# EAGLE board Lusso (EAGLE 9.0.0)
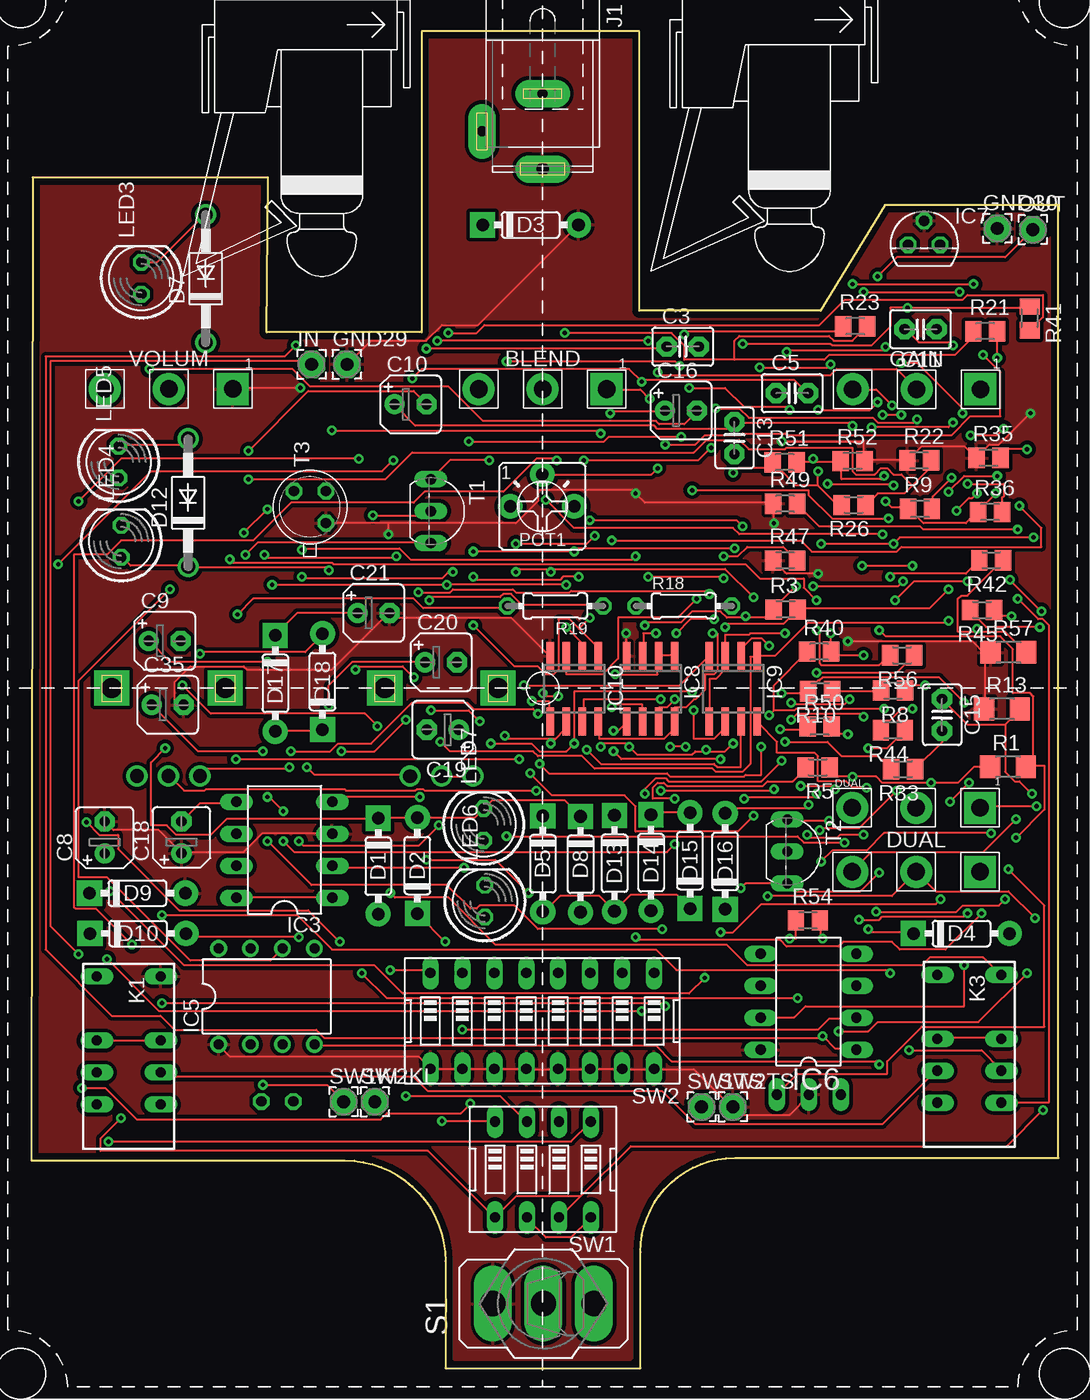
[diagram p2: board, top side]
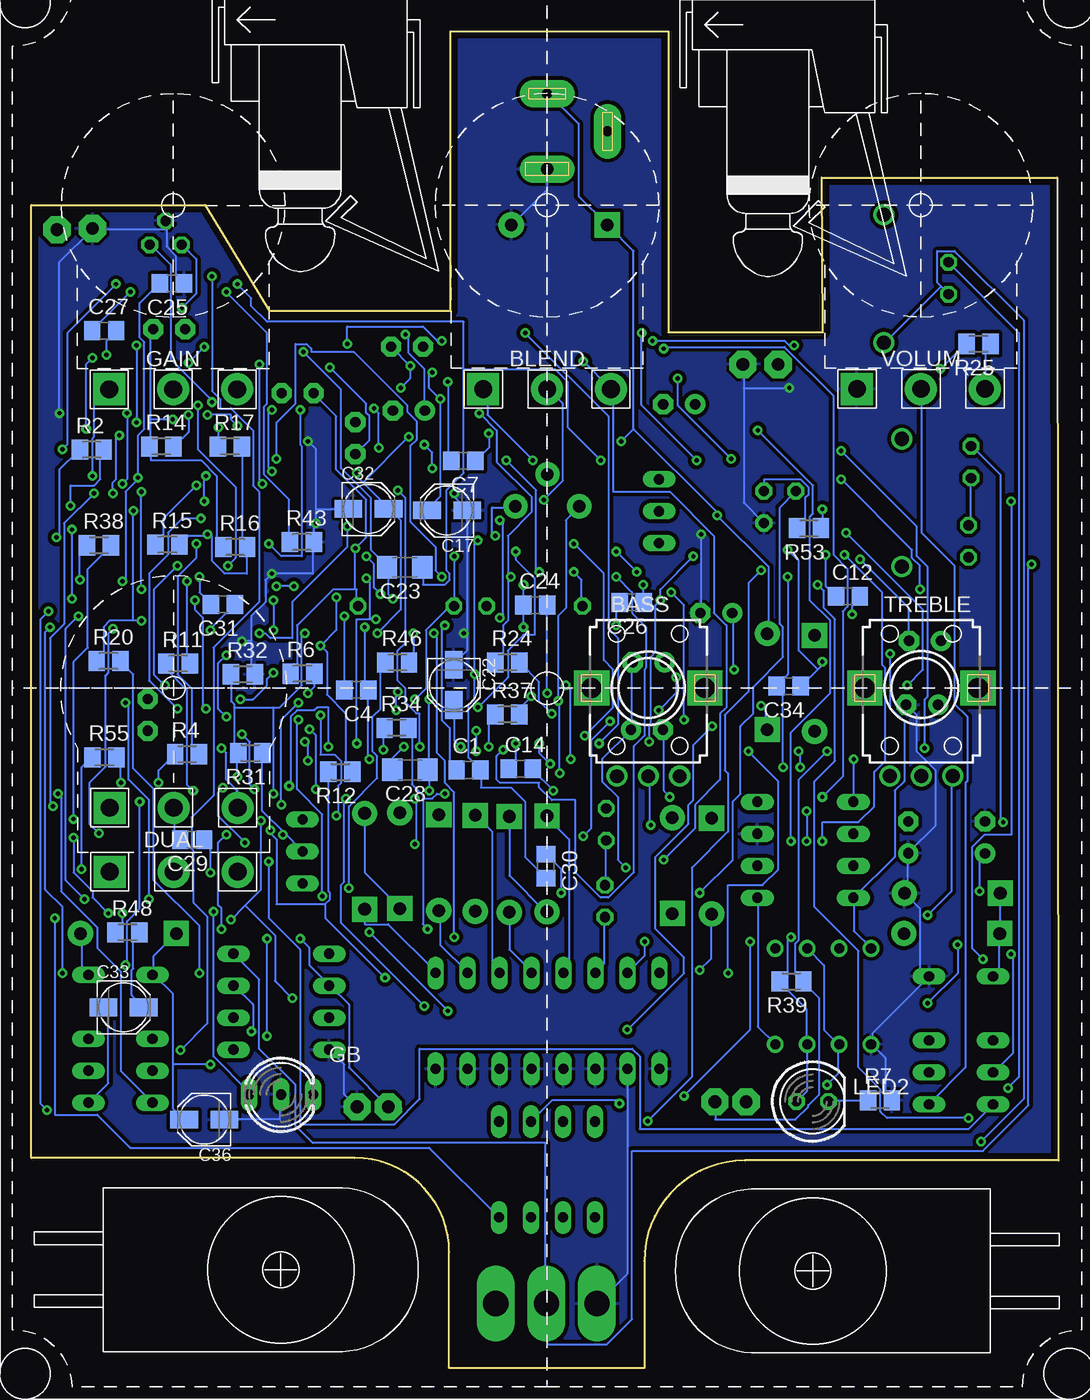
[diagram p3: board, bottom side, seen from below]

Size 81.6 x 106.2 mm. Coordinates in mm from the lower left corner, seen from the top.
Outline: 0,16.5 24.9,16.5 arc-90 32.9,8.5 32.9,0 48.4,0 48.4,9.2 arc-90 55.9,16.7 81.6,16.7 81.6,92.4 67.8,92.4 62.7,84 48.3,84 48.3,106.2 31,106.2 31,82.3 18.7,82.3 18.8,94.6 0.1,94.6 0,16.5
Copper layers (1*16): Top 0.035mm / dielectric 1.5mm / Bottom 0.035mm
Design rules "default *": minimum track width 6mil, minimum drill 0.35mm, track to track 6mil, track to pad 6mil, pad to pad 6mil, via to via 10mil, smd to smd 6mil, copper to edge 20mil, drill to drill 10mil, minimum pad ring 10mil, minimum via ring 8mil, stop-mask expansion 4mil, vias tented up to drill 0mil, thermal gap 10mil

## Footprints (pad centres in the part's own frame; a part is rotated, then mirrored left to right if it is on the bottom)
EVUF = drill 1.1 pad 1.676: 1 -2.5,-7; 2 0,-7; 3 2.5,-7 | drill 1.6 pad 2.8 square: M1 4.5,0; M2 -4.5,0
16MM_B.MOUNT = drill 1.4 pad 2.54 square: 1 5.08,0 | drill 1.4 pad 2.54: 2 0,0; 3 -5.08,0
C0805 = smd 1.3 x 1.5: 1 -0.95,0; 2 0.95,0
C2.5-3 = drill 0.813 pad 1.6 octagon: 1 -1.27,0; 2 1.27,0
B45181A = drill 0.813 pad 1.6: + -1.27,0 | drill 0.813 pad 1.6 octagon: - 1.27,0
PANASONIC_B = smd 2.2 x 1.4: + 1.6,0; - -1.6,0
C1206 = smd 1.6 x 1.8: 1 -1.4,0; 2 1.4,0
DO35-3 = drill 1 pad 2: A 3.81,0 | drill 1 pad 2 square: C -3.81,0
DO41-10 = drill 1.118: A 5.08,0; C -5.08,0
16MM_DUALGANG = drill 1.4 pad 2.54 square: 1 5.08,0; 4 5.08,5.08 | drill 1.4 pad 2.54: 2 0,0; 3 -5.08,0; 5 0,5.08; 6 -5.08,5.08
DUOLED-C-5MM = drill 0.813 long: AR 2.54,0; AX -2.54,0; C 0,0
2,15/1,0 = drill 1.016 pad 2.159 octagon: 1 0,0
DIL08 = drill 0.813 long: 1 -3.81,-3.81; 2 -1.27,-3.81; 3 1.27,-3.81; 4 3.81,-3.81; 5 3.81,3.81; 6 1.27,3.81; 7 -1.27,3.81; 8 -3.81,3.81
DIL08' = drill 0.813 pad 1.27: 1 -3.81,-3.81; 2 -1.27,-3.81; 3 1.27,-3.81; 4 3.81,-3.81; 5 3.81,3.81; 6 1.27,3.81; 7 -1.27,3.81; 8 -3.81,3.81
DIL8 = drill 0.813 long: 1 -3.81,-3.81; 2 -1.27,-3.81; 3 1.27,-3.81; 4 3.81,-3.81; 5 3.81,3.81; 6 1.27,3.81; 7 -1.27,3.81; 8 -3.81,3.81
TO92 = drill 0.813 octagon: 1 -1.27,0; 2 0,1.905; 3 1.27,0
SO08 = smd 0.6 x 2.2: 1 -1.905,-2.6; 2 -0.635,-2.6; 3 0.635,-2.6; 4 1.905,-2.6; 5 1.905,2.6; 6 0.635,2.6; 7 -0.635,2.6; 8 -1.905,2.6
SPC4077 = drill 0.8 pad 2.184 long: 1 -3,0; 2 0,-4.8 | drill 1 pad 2.184 long: 3 3,0
NA = drill 0.8 long: 1 -6.35,-2.54; 3 -1.27,-2.54; 4 1.27,-2.54; 5 3.81,-2.54; 8 3.81,2.54; 9 1.27,2.54; 10 -1.27,2.54; 12 -6.35,2.54
LED5MM = drill 0.813 octagon: A -1.27,0; K 1.27,0
TRIM1 = drill 1 pad 1.93: 1 -2.54,0; 2 0,2.54; 3 2.54,0
R1206 = smd 1.6 x 1.803: 1 -1.422,0; 2 1.422,0
M0805 = smd 1.3 x 1.6: 1 -0.95,0; 2 0.95,0
0204/7 = drill 0.813 octagon: 1 -3.81,0; 2 3.81,0
320-916 = drill 2.007 long: 1 0,4.013; 2 0,0; 3 0,-4.013
EDG-04 = drill 0.813 long: 1 -3.81,-3.81; 2 -1.27,-3.81; 3 1.27,-3.81; 4 3.81,-3.81; 5 3.81,3.81; 6 1.27,3.81; 7 -1.27,3.81; 8 -3.81,3.81
EDG-08 = drill 0.813 long: 1 -8.89,-3.81; 2 -6.35,-3.81; 3 -3.81,-3.81; 4 -1.27,-3.81; 5 1.27,-3.81; 6 3.81,-3.81; 7 6.35,-3.81; 8 8.89,-3.81; 9 8.89,3.81; 10 6.35,3.81; 11 3.81,3.81; 12 1.27,3.81; 13 -1.27,3.81; 14 -3.81,3.81; 15 -6.35,3.81; 16 -8.89,3.81
TO92-ECB = drill 0.813 long: B 2.54,0; C 0,0; E -2.54,0
TO18 = drill 0.813 octagon: 1 -1.27,-1.27; 2 1.27,-1.27; 3 1.27,1.27

## Placement (x,y rotation side)
BASS  50K  [EVUF]  32.59,54.03 0 bottom
BLEND  100k  [16MM_B.MOUNT]  40.62,77.79 0 top
C1  100nf  [C0805]  46.87,47.52 0 bottom
C3  390nF  [C2.5-3]  51.75,81.16 0 top
C4  68nF  [C0805]  55.78,53.88 180 bottom
C5  82Nf  [C2.5-3]  60.45,77.46 0 top
C7  220nF  [C0805]  47.28,72.08 180 bottom
C8  1 UF  [B45181A]  5.82,42.15 90 top
C9  1 UF  [B45181A]  10.59,57.78 0 top
C10  1 UF  [B45181A]  30.13,76.58 0 top
C11  27nF  [C2.5-3]  70.65,82.54 180 top
C12  820pf  [C0805]  16.72,61.32 0 bottom
C13  2.2nF  [C2.5-3]  55.86,73.9 270 top
C14  3.9nF  [C0805]  42.72,47.62 0 bottom
C15  18nF  [C2.5-3]  72.36,51.9 270 top
C16  4.7 UF  [B45181A]  51.61,76.08 0 top
C17  47 Uf  [PANASONIC_B]  48.57,68.14 180 bottom
C18  1 UF  [B45181A]  11.92,42.17 90 top
C19  1 UF  [B45181A]  32.69,50.72 180 top
C20  1 UF  [B45181A]  32.55,56.08 0 top
C21  1 UF  [B45181A]  27.18,60 0 top
C22  47 Uf  [PANASONIC_B]  48.04,54.28 270 bottom
C23  1uf  [C1206]  51.94,63.63 180 bottom
C24  47nF  [C0805]  41.57,60.62 0 bottom
C25  220nF  [C0805]  70.43,86.18 180 bottom
C26  56pf  [C0805]  33.91,60.83 180 bottom
C27  220nF  [C0805]  75.82,82.42 0 bottom
C28  1uf  [C1206]  51.52,47.53 180 bottom
C29  100nf  [C0805]  68.83,41.98 180 bottom
C30  68nF  [C0805]  40.72,39.88 270 bottom
C31  100nf  [C0805]  66.38,60.68 180 bottom
C32  100Uf  [PANASONIC_B]  54.83,68.26 0 bottom
C33  10 Uf  [PANASONIC_B]  74.28,28.66 0 bottom
C34  330pF  [C0805]  21.43,54.18 180 bottom
C35  1 UF  [B45181A]  10.82,52.7 0 top
C36  47 Uf  [PANASONIC_B]  67.87,19.74 180 bottom
D1  1n34  [DO35-3]  27.55,39.88 270 top
D2  1n34  [DO35-3]  30.67,39.92 90 top
D3  1n4742  [DO35-3]  39.66,90.83 0 top
D4  1n4004  [DO35-3]  73.9,34.53 0 top
D5  1n34  [DO35-3]  40.63,40.06 270 top
D7  1N4004  [DO41-10]  13.85,86.55 90 top
D8  1n914  [DO35-3]  43.63,40.02 270 top
D9  1n4004  [DO35-3]  8.42,37.73 0 top
D10  1n4004  [DO35-3]  8.46,34.53 0 top
D12  1N34A  [DO41-10]  12.45,68.75 90 top
D13  1n914  [DO35-3]  46.33,40.1 270 top
D14  1n34  [DO35-3]  49.23,40.16 270 top
D15  1n34  [DO35-3]  52.33,40.32 90 top
D16  1n914  [DO35-3]  55.13,40.26 90 top
D17  1n4004  [DO35-3]  19.37,54.4 270 top
D18  1n4004  [DO35-3]  23.13,54.54 90 top
DUAL  100k  [16MM_DUALGANG]  70.3,39.43 0 top
GAIN  100k  [16MM_B.MOUNT]  70.34,77.77 0 top
GB  [DUOLED-C-5MM]  61.77,21.73 0 bottom
GND29  GND jack  [2,15/1,0]  25.07,79.75 0 top
GND30  GND jack  [2,15/1,0]  76.75,90.55 0 top
IC3  ICL7660CPA  [DIL08]  20.1,41.18 90 top
IC5  LM555N  [DIL08']  18.68,29.53 0 top
IC6  PIC12F675P  [DIL8]  61.75,29.11 90 top
IC7  78L05Z  [TO92]  70.94,89.25 0 top
IC8  TL072D  [SO08]  49.2,53.97 180 top
IC9  TL072D  [SO08]  55.76,53.97 180 top
IC10  TL072D  [SO08]  43.12,53.97 180 top
IN  IN jack  [2,15/1,0]  22.26,79.75 0 top
J1  [SPC4077]  40.62,98.26 270 top
K1  NA  [NA]  7.73,24.76 270 top
K3  NA  [NA]  74.53,24.9 270 top
LED2  [LED5MM]  19.54,21.18 0 bottom
LED3  [LED5MM]  8.73,86.59 90 top
LED4  [LED5MM]  7.13,65.69 90 top
LED5  [LED5MM]  6.93,71.99 90 top
LED6  B  [LED5MM]  36.03,37.09 90 top
LED7  B  [LED5MM]  35.93,43.19 90 top
OUT  OUT jack  [2,15/1,0]  79.57,90.45 0 top
POT1  20k  [TRIM1]  40.6,68.46 0 top
R1  1M  [R1206]  77.6,47.77 0 top
R2  5.1k  [M0805]  76.81,72.97 0 bottom
R3  10k  [M0805]  59.94,60.27 0 top
R4  1.5k  [M0805]  69.23,48.77 0 bottom
R5  1k  [M0805]  62.48,47.73 180 top
R6  15k  [M0805]  60.06,55.17 0 bottom
R7  10k  [M0805]  14.18,21.27 0 bottom
R8  1k  [M0805]  68.46,53.83 180 top
R9  10k  [M0805]  70.6,68.27 0 top
R10  1k  [M0805]  62.67,53.78 180 top
R11  1.5k  [M0805]  69.95,55.97 0 bottom
R12  15k  [M0805]  57.05,47.38 180 bottom
R13  1M  [R1206]  77.12,52.37 0 top
R14  47k  [M0805]  71.27,73.22 0 bottom
R15  22k  [M0805]  70.79,65.42 0 bottom
R16  27k  [M0805]  65.41,65.22 0 bottom
R17  12k  [M0805]  65.83,73.22 0 bottom
R18  422K  [0204/7]  51.84,60.55 0 top
R19  392K  [0204/7]  41.62,60.55 180 top
R20  1.8k  [M0805]  75.47,56.17 0 bottom
R21  100k  [M0805]  75.79,82.37 0 top
R22  10k  [M0805]  70.55,72.12 0 top
R23  100k  [M0805]  65.44,82.77 0 top
R24  4.7k  [M0805]  43.79,56.07 0 bottom
R25  560R  [M0805]  6.33,81.38 180 bottom
R26  10k  [M0805]  65.33,68.58 180 top
R31  27k  [M0805]  64.21,48.88 180 bottom
R32  27k  [M0805]  64.81,55.12 0 bottom
R33  1k  [M0805]  69.27,47.58 180 top
R34  510k  [M0805]  52.59,50.87 0 bottom
R35  10k  [M0805]  76.05,72.32 0 top
R36  10k  [M0805]  76.17,68.02 0 top
R37  4.7k  [M0805]  43.79,51.92 0 bottom
R38  220k  [M0805]  76.24,65.37 0 bottom
R39  100k  [M0805]  21.21,30.73 180 bottom
R40  1k  [M0805]  62.59,56.92 0 top
R41  10k  [M0805]  79.32,83.39 270 top
R42  10k  [M0805]  76.27,64.18 180 top
R43  220R  [M0805]  60.12,65.62 0 bottom
R44  1k  [M0805]  68.45,50.68 180 top
R45  10k  [M0805]  75.54,60.23 180 top
R46  510k  [M0805]  52.54,56.07 0 bottom
R47  10k  [M0805]  59.88,64.17 0 top
R48  100R  [M0805]  73.97,34.62 0 bottom
R49  10k  [M0805]  59.9,68.67 0 top
R50  1k  [M0805]  62.62,50.97 0 top
R51  10k  [M0805]  59.84,71.97 0 top
R52  10k  [M0805]  65.26,72.07 0 top
R53  10k  [M0805]  19.82,66.73 180 bottom
R54  10k  [M0805]  61.7,35.57 0 top
R55  1.8k  [M0805]  75.81,48.52 0 bottom
R56  1k  [M0805]  69.18,56.63 180 top
R57  1M  [R1206]  77.64,56.87 0 top
S1  [320-916]  40.68,5.12 90 top
SW1  [EDG-04]  40.64,15.78 180 top
SW1KL  Sw 1KL  [2,15/1,0]  24.81,21.15 0 top
SW1TS  Sw 1TS  [2,15/1,0]  53.25,20.75 359.8 top
SW2  [EDG-08]  40.59,27.58 180 top
SW2KL  SW 2KL  [2,15/1,0]  27.29,21.15 359.9 top
SW2TS  Sw 2TS  [2,15/1,0]  55.73,20.75 0 top
T1  2SC1815  [TO92-ECB]  31.73,68.08 270 top
T2  2SC1815  [TO92-ECB]  60.06,41.05 270 top
T3  2n222  [TO18]  22.13,68.41 90 top
TREBLE  10K  [EVUF]  10.88,54.03 0 bottom
U$1  [1590BB]  40.62,54.03 0 top
U$2  [LUMBURG_SIDE]  23.07,108.24 90 top
U$3  [LUMBURG_SIDE]  60.24,108.64 90 top
U$4  [MOMENTARY]  19.51,7.72 0 top
U$5  [MOMENTARY]  61.78,7.81 180 top
VOLUM  10k  [16MM_B.MOUNT]  10.92,77.79 0 top

## Tracks (layer width: path | path; a pad name or v marks a point on that pad's centre or on a via)
5V  (via drill 0.35)
  Top 0.152: v62.88,34.12 62.75,34.12 62.75,35.5 R54.2 | IC6.1 65.5,25.38 63.88,25.38 v62.88,26.38 62.75,26.25 23.25,26.25 22.62,26.88 11.38,26.88 10.25,28 6.38,28 1.12,33.25 1.12,80.38 20.12,80.38 v21,81.25 | R41.1 79.25,84.25 v69.62,84.25 68.25,84.25 68.25,82.75 66.75,81.25 63.62,81.25 63.5,81.38 v56.5,81.38 | v49,81.62 v32.25,81.62
  Bottom 0.152: v62.88,26.38 v62.88,34.12 | v69.62,84.25 68.5,85.38 68.5,88.12 69.62,89.25 IC7.1 | v21,81.25 21.38,81.25 21.75,81.62 v32.25,81.62 | v49,81.62 49.38,81.62 50.5,82.75 56.5,82.75 v56.5,81.38
9V  (via drill 0.35)
  Top 0.152: IC10.8 45.12,51.25 45.12,50 50.25,50 51,50.75 51,51.25 IC8.8 51.12,51.38 51.12,52.5 52,52.5 52.62,53.12 52.75,53.12 53.5,53.88 53.5,55.12 54.25,55.12 54.5,55.38 54.5,58.38 v54.12,58.38 | 59.38,71.5 60.75,70.12 62.5,70.12 | 59.38,71.5 59,71.88 R51.1 59.38,71.5 | 62.5,70.12 64,68.62 64.38,68.62 R26.2 | v55.75,71.12 56.12,71.5 59.38,71.5 | v67.25,76.75 66.62,76.12 v62.5,76.12 | 62.5,70.12 v62.5,71.25 | v61.62,42.38 61.88,42.12 64,42.12 64.25,42.38 v66.12,42.38 | v66.5,34.88 66.75,34.62 70,34.62 D4.C | IC3.8 16.38,37.38 23.88,37.38 IC3.1 | v27.12,67.75 31.38,67.75 31.62,68 T1.C | v13.38,56.75 13.5,56.88 21.75,56.88 23.12,58.25 D18.A | v67.38,24.12 67.12,24.38 50.88,24.38 49.62,25.62 22.5,25.62 IC5.4 | v51.62,74 45.88,74 45.5,73.62 v34.75,73.62
  Bottom 0.152: 55.25,70.38 55.75,70.88 v55.75,71.12 | 55.25,70.38 53.25,68.38 C32.+ 53.12,68.25 52.25,67.38 52.25,60.25 v54.12,58.38 | v67.25,76.75 67.25,76.88 70.5,80.12 70.5,87.62 72.12,89.25 IC7.3 | v62.5,76.12 62.75,75.88 62.75,71.5 v62.5,71.25 | 61.5,42.5 60.12,41.12 T2.C | 61.5,42.5 63.25,44.25 R31.1 | 70.38,24.12 70.38,29.75 71.88,31.25 | 70.38,24.12 70.38,20.62 69.5,19.75 C36.+ | 71.88,31.25 71.88,32.75 70.12,34.5 D4.C | 71.88,31.25 K3.1 | v61.62,42.38 61.5,42.5 | v66.12,42.38 66.75,41.75 66.75,36.75 66.5,36.5 v66.5,34.88 | IC5.8 14.88,33.38 16.25,34.75 16.25,37.25 IC3.8 16.25,37.38 13,40.62 13,45.88 12.25,46.62 12.25,51.38 13.38,52.5 v13.38,56.75 | IC5.4 22.5,25.75 23.88,27.12 23.88,37.25 IC3.1 | J1.1 40.5,101.25 38.12,98.88 38.12,93.12 35.88,90.88 D3.C 35.75,90.75 33.75,88.75 33.75,74.62 | D18.A 23.12,58.38 23,58.5 23,63.62 v27.12,67.75 27.12,68 33.75,74.62 | v67.38,24.12 70.38,24.12 | v51.62,74 55.25,70.38 | 33.75,74.62 v34.75,73.62
GND  (via drill 0.35)
  Top 0.152: v21.38,77.88 16,77.88 VOLUM.1 | D3.A 43.38,90.75 35.5,82.88 32.62,82.88 31.38,81.62 27,81.62 25.12,79.75 GND29.1 | v47.25,58.38 47.25,56.62 IC8.4 | 75.75,56.75 75.75,52.38 R13.1 | 75.75,56.75 76.12,56.75 R57.1 75.75,56.75 | v62.5,63.12 60,63.12 59,64.12 R47.1 | v59,67.12 59,68.62 R49.1 58.88,68.75 48.75,68.75 v48,69.5 47.75,69.75 40.25,69.75 40.25,68.88 38.5,67.12 28.38,67.12 | 75.75,56.75 74.75,57.75 v64.88,57.75 | v59.62,73.62 66.12,73.62 66.12,72.12 R52.2 66.25,72.12 69.5,72.12 R22.1 69.62,72.12 70.75,73.25 74.12,73.25 75,72.38 R35.1 75.12,72.38 76.12,73.38 76.88,73.38 v79.38,75.88 | 28.38,67.12 23.5,67.12 T3.1 | GB.C 61.75,21.62 60.25,20.12 56.38,20.12 55.75,20.75 SW2TS.1 55.62,20.75 52.62,23.75 49.5,23.75 SW2.16 49.38,23.75 47,23.75 SW2.15 46.88,23.75 44.5,23.75 SW2.14 44.38,23.75 41.88,23.75 SW2.13 41.75,23.75 39.38,23.75 SW2.12 39.25,23.75 36.88,23.75 SW2.11 36.75,23.75 34.25,23.75 SW2.10 34.12,23.75 31.75,23.75 SW2.9 31.62,23.88 30.75,24.75 15.75,24.75 14.88,25.62 IC5.1 | IC10.4 41.12,56.62 38.12,59.62 28.88,59.62 28.5,60 C21.- 28.38,60 23.88,55.5 17.12,55.5 16.88,55.75 12.62,55.75 11.38,54.5 11.38,52.75 12,52.75 C35.- | IC3.3 23.88,42.5 18.38,42.5 16.88,41 12,41 C18.+ 11.88,41 10.12,42.75 6.5,42.75 5.88,43.38 C8.- | v28.38,66.25 28.38,67.12
  Bottom 0.152: D3.A 43.38,90.88 40.62,93.62 J1.3 | 25,77.88 25,79.75 GND29.1 | 25,77.88 25,68.75 23.5,67.25 T3.1 | 25,77.88 v21.38,77.88 | 70.88,90.5 70.88,91.12 IC7.2 70.88,90.5 | 70.88,90.5 70.88,89.12 70.12,88.38 70.12,86.88 69.5,86.25 C25.1 | 76.75,90.5 70.88,90.5 | 47,58.38 47,68.12 C17.- 47,68.25 48,69.25 v48,69.5 | 47,58.38 47,57 48,56 C22.- | 47,58.38 v47.25,58.38 | 64.12,57.75 64.12,59.75 63,60.88 63,62.62 v62.5,63.12 59.25,63.12 59.25,65.5 R43.2 59.12,65.62 59.12,67 v59,67.12 59,68.25 | 64.12,57.75 64.12,55.38 63.88,55.12 R32.2 | 59,68.25 56.5,68.25 C32.- | 64.12,57.75 v64.88,57.75 | v59.62,73.62 59,73 59,68.25 | 76.75,90.5 79.38,87.88 v79.38,75.88 | 76.75,90.5 GND30.1 | C36.- 66.25,19.75 61.88,19.75 61.88,21.62 GB.C | IC6.8 57.88,25.25 56.75,24.12 56.75,21.75 55.75,20.75 SW2TS.1 | S1.1 36.62,5.12 34.25,7.5 34.25,23.75 SW2.10 | R7.2 13.25,21.38 13.75,21.88 13.75,24.62 14.75,25.62 IC5.1 14.75,25.75 14.75,26.62 10.38,31 K1.12 10.38,31.12 11,31.75 11,36.5 D9.A 12.12,37.75 12,37.88 12,40.88 C18.+ 11.88,41 9.75,43.12 9.75,47.5 11.25,49 11.25,51.88 12,52.62 C35.- | v28.38,66.25 28.38,60 C21.-
  pour Top (isolate 0.305): 0.2,16.7 25.3,16.7 25.4,16.7 arc-90 33.5,8.6 33.5,8.5 33.3,8.3 33.3,0.9 33.8,0.4 47.4,0.4 48,1 48,9.5 48.1,9.6 48.1,10 arc-90 55.2,17.1 81.4,17.1 81.4,18.4 81.4,92.2 68,92.2 62.9,83.8 48.1,83.8 48.1,106 31.2,106 31.2,82.1 18.6,82.1 18.6,94.4 0.2,94.4
  pour Bottom (isolate 0.305): 0.5,16.8 25,16.8 25.2,16.8 arc-90 33.4,8.6 33.4,0.3 48.1,0.3 48.1,9.4 arc-90 55.7,17 81.4,17 81.4,92.2 68.2,92.2 62.9,83.7 48,83.7 48,105.9 31.3,105.9 31.3,82.1 18.5,82.1 18.5,94.3 0.5,94.3
N$1  (via drill 0.35)
  Top 0.152: v68.25,62.88 68.5,63.12 74.25,63.12 75.25,64.12 R42.2
  Bottom 0.152: v68.25,62.88 68.25,61.62 67.38,60.75 C31.2
N$2  (via drill 0.35)
  Top 0.152: v67.38,58.62 67.88,58.12 77,58.12 78,57.12 78,53.62 79.38,53.62 79.62,53.38 79.62,47.88 | 79.62,47.88 79.12,47.88 R1.2 79.62,47.88 | v49.62,58.38 48.62,58.38 48.62,56.62 IC8.3 | v48,34.25 48.25,34 59.5,34 60,33.5 64.12,33.5 64.5,33.88 68.38,33.88 69,33.25 72.62,33.25 v75.5,36.12 | v78.25,42.12 80.5,44.38 80.5,47.88 79.62,47.88
  Bottom 0.152: v67.38,58.62 67.38,58.75 65.5,60.62 C31.1 | v49.62,58.38 49.38,58.12 49.38,48.88 48.75,48.25 48.75,46.5 48,45.75 v48,34.25 | v75.5,36.12 76.75,37.38 76.75,37.88 78.25,39.38 v78.25,42.12
N$3  (via drill 0.35)
  Top 0.152: IC8.1 51,56.62 49.88,56.62 IC8.2 49.75,56.5 49.75,55.12 v46.38,55.12 | v78.5,68.5 80.25,66.75 80.25,65.25 69.12,65.25 68.75,64.88 62,64.88 61.12,65.75 v46.12,65.75
  Bottom 0.152: C30.2 40.75,39 42.38,40.62 42.38,45 43.5,46.12 45.88,46.12 45.88,47.5 C1.2 46,47.62 46.88,48.5 46.88,52.62 46.38,53.12 v46.38,55.12 46.38,65.5 v46.12,65.75 | v78.5,68.5 78.5,70.12 76.62,70.12 76.12,70.62 76.12,72.62 75.88,72.88 R2.2
N$4  (via drill 0.35)
  Top 0.152: v79.62,66 69,66 v68.5,65.5 v62.75,65.5 | v39.5,37.75 36.88,40.38 v31.38,40.38 | v51.5,79.62 51.12,80 v37.75,80 | v60.25,76.12 60,76.38 56.62,76.38 55.12,77.88 v52.25,77.88
  Bottom 0.152: v68.5,65.5 68.5,64.38 70,62.88 70,55.12 68.88,54 68.88,49.38 68.38,48.88 R4.2 | v79.62,66 79.38,66.25 79.38,71.38 77.88,72.88 R2.1 | v39.5,37.75 39.5,39.62 40.62,40.75 C30.1 | v31.38,40.38 28.88,42.88 28.88,44.75 26.88,46.75 26.88,52 26.38,52.5 26.38,59 27.38,60 27.38,66.12 30.88,69.62 35.38,69.62 35.38,77.62 35.5,77.75 BLEND.3 35.62,77.88 v37.75,80 | C3.2 53,81.12 v51.5,79.62 51.5,78.62 v52.25,77.88 | v62.75,65.5 61.75,64.5 60.12,64.5 60.12,73.25 60.25,73.38 v60.25,76.12
N$5  (via drill 0.35)
  Top 0.152: v45.25,74.25 45,74.5 v23.88,74.5 | v21.25,41.88 21.62,41.5 30.75,41.5 v32.38,43.12 | BASS.1 35,47 32.62,47 BASS.2
  Bottom 0.152: v45.25,74.25 45.25,73.12 46.25,72.12 C7.1 | v23.88,74.5 19.5,70.12 19.5,67.88 19.75,67.62 19.75,61 18.12,59.38 18.12,53.62 21.25,50.5 v21.25,41.88 | v32.38,43.12 32.5,43.25 32.5,47 BASS.2
N$6  (via drill 0.35)
  Top 0.152: v51.12,45.25 49.38,45.25 49.38,46.12 49.75,46.5 50.25,46.5 50.5,46.25 58.12,46.25 58.5,46.62 60.5,46.62 61.5,47.62 R5.2 | v51.12,41.62 50.5,41 20.88,41 v20,41.88 | v20,44.25 18.88,45.38 v18.75,45.38 | v31.38,81 50.25,81 50.38,81.12 C3.1
  Bottom 0.152: v51.12,45.25 51,45.12 51,41.75 v51.12,41.62 | v20,44.25 v20,41.88 | v18.75,45.38 17.12,47 17.12,60.12 16.75,60.5 16.75,63.5 17.88,64.62 17.88,77.25 21.75,81.12 31.38,81.12 v31.38,81
N$7  (via drill 0.35)
  Top 0.152: v48.75,59 49,59.25 51.62,59.25 52.5,60.12 54.75,60.12 55.25,59.62 56.75,59.62 | 56.75,59.62 58.25,59.62 58.88,60.25 R3.1 59,60.38 v60.75,62.12 | 56.75,59.62 v56.75,59.75 | v69.25,62.5 68.88,62.12 v62.12,62.12
  Bottom 0.152: v48.75,59 49,58.75 49,51.5 48.38,50.88 48.38,48.12 47.88,47.62 C1.1 | v56.75,59.75 56.75,54 C4.2 | v69.25,62.5 69.25,56.25 69,56 R11.2 | v60.75,62.12 v62.12,62.12
N$8  (via drill 0.35)
  Top 0.152: v55.12,58.88 55.38,59.12 59.75,59.12 60.88,60.25 R3.2 61,60.38 71.38,60.38 v72.88,61.88 | v46.25,50.62 46.62,50.62 47.25,51.25 IC8.5 | v46.25,49 46.88,48.38 v54.75,48.38 | v76.75,70.88 74.12,70.88 v72.88,69.62
  Bottom 0.152: v55.12,58.88 55.12,54.25 54.88,54 C4.1 54.88,53.88 54.88,48.5 v54.75,48.38 | v46.25,49 v46.25,50.62 | v76.75,70.88 76.75,73.88 76.62,74 76.62,76.62 75.5,77.75 GAIN.1 | v72.88,61.88 v72.88,69.62
N$9  (via drill 0.35)
  Top 0.152: v71,54.25 69.88,54.25 69.5,53.88 R8.1 | v66,63.75 v70,63.75 | v68.38,76.5 67.12,77.75 65.38,77.75 GAIN.3
  Bottom 0.152: v71,54.25 71.88,55.12 71.88,61.88 v70,63.75 | v66,63.75 65.38,64.38 65.38,70 68.38,73 v68.38,76.5
N$10  (via drill 0.35)
  Top 0.152: v59.62,53.62 61.5,53.62 61.62,53.75 R10.2 61.75,53.88 62.5,54.62 62.62,54.62 62.88,54.88 72.12,54.88 v74.12,52.88 | C5.2 61.62,77.5 60.62,78.5 48.62,78.5 v48.5,78.38 47.5,79.38 31,79.38 v30.25,78.62 | v72.25,37.25 71.88,36.88 58,36.88 55.75,34.62 v54.75,34.62 | v48.5,28.38 10.12,28.38 v6,32.5 | v3.75,68.88 7.12,72.25 v26,72.25
  Bottom 0.152: v59.62,53.62 59.12,54.12 59.12,55.12 R6.2 | v48.5,78.38 48.5,72.38 48.25,72.12 C7.2 | v74.12,52.88 73.88,52.62 73.88,46.75 72.25,45.12 v72.25,37.25 | v48.5,28.38 v54.75,34.62 | v6,32.5 6.88,33.38 6.88,41.38 5.88,42.38 3.75,42.38 v3.75,68.88 | v26,72.25 30.25,76.5 v30.25,78.62
N$11  (via drill 0.35)
  Top 0.152: v21.88,47.75 22.5,47.12 30,47.12 BASS.3 | v46.12,52.5 46.38,52.75 48.5,52.75 48.5,51.38 IC8.6 | v55.88,65.12 43.38,65.12 v43.12,64.88 v35.12,64.88 | v21.5,62.88 21.62,62.75 32.62,62.75 33.12,63.25 v33.5,63.25
  Bottom 0.152: v21.88,47.75 21.88,53.62 22.38,54.12 C34.2 22.38,54.25 21.5,55.12 v21.5,62.88 | 55.88,61.88 55.75,61.88 55.75,60.62 R18.2 | 55.88,61.88 57.62,61.88 60.5,59 60.5,55.75 61,55.25 R6.1 | v46.12,52.5 43.75,54.88 43.75,57 42.5,58.25 41.62,58.25 41.62,62.75 43.12,64.25 v43.12,64.88 | 55.88,61.88 v55.88,65.12 55,66 55,69 57.38,71.38 57.38,75.62 59.12,77.38 C5.1 | v35.12,64.88 v33.5,63.25
N$12  (via drill 0.35)
  Top 0.152: v18.5,64.62 18.75,64.38 28.88,64.38 v29,64.5 | v31.62,61 31.88,61.25 37.25,61.25 37.5,61.5 38.12,61.5 39,60.62 45.38,60.62 R19.1 | v72.88,59.38 72.75,59.25 61.75,59.25 59.12,56.62 57.75,56.62 IC9.1 57.62,56.5 57.12,56.5 57.12,48 56.5,47.38 54.38,47.38 54.12,47.62 44.75,47.62 43.75,48.62 40.25,48.62 39.88,49 33.25,49 v32.5,49.75 | v76.75,80.25 76.75,82.25 R21.2 | v77.25,74.62 76.75,74.12 v74.62,74.12 | v75.12,69.5 74.75,69.12 74.5,69.12 v73.5,68.12
  Bottom 0.152: v18.5,64.62 18.5,62.12 17.75,61.38 C12.1 | v29,64.5 31.62,61.88 v31.62,61 32,60.62 32,56.88 32.38,56.5 32.38,51.25 32.5,51.12 v32.5,49.75 | v72.88,59.38 73.5,59.38 | 73.5,59.38 75.38,59.38 75.88,58.88 75.88,56.75 76.38,56.25 R20.1 | v76.75,80.25 77.25,79.75 v77.25,74.62 | v74.62,74.12 74.88,73.88 74.88,70.62 75.12,70.38 v75.12,69.5 | 73.5,59.38 v73.5,68.12
N$13
  Top 0.152: K3.3 72,26.25 77,26.25 K3.10
N$14  (via drill 0.35)
  Top 0.152: v62.62,42.75 62.75,42.88 65.75,42.88 v68.75,45.88 | v6.25,37.88 12.12,32 27.25,32 29.5,29.75 52.25,29.75 v53.5,31
  Bottom 0.152: R12.2 58,37.88 57.88,37.75 57.88,37.25 58.25,36.88 | 58.25,36.88 62.12,36.88 62.12,42 62.62,42.5 v62.62,42.75 | v68.75,45.88 69.25,46.38 69.25,53.88 70.88,55.5 70.88,55.88 R11.1 | v6.25,37.88 6.25,40.5 5.88,40.88 C8.+ | v53.5,31 58.25,35.75 58.25,36.88
N$15  (via drill 0.35)
  Top 0.152: v68.25,31.38 68,31.62 51.25,31.62 49.62,33.25 23.88,33.25 21.12,36 v10.38,36
  Bottom 0.152: v68.25,31.38 68.25,35.12 71.88,38.75 71.88,46 73.5,47.62 73.5,55.12 74.5,56.12 R20.2 | v10.38,36 8.5,37.88 8.5,47 TREBLE.3
N$16  (via drill 0.35)
  Top 0.152: v51.12,53.12 50.5,52.5 49.88,52.5 49.88,51.38 IC8.7 | v18.75,56.12 11,56.12 9.38,57.75 C9.+ | v48,64.5 47.75,64.25 30.12,64.25 29.25,65.12 21.62,65.12 v21.5,65
  Bottom 0.152: v51.12,53.12 50.25,54 50.25,58.62 48.38,60.5 48.12,60.5 R18.1 48,60.62 v48,64.5 | 19.12,55.5 18.75,55.88 v18.75,56.12 | 19.12,55.5 20.38,54.25 C34.1 | v21.5,65 20.62,64.12 20.62,57 19.12,55.5
N$17  (via drill 0.35)
  Top 0.152: v62.38,58.62 62.62,58.62 62.62,56 62.75,55.88 67.38,55.88 68.12,56.62 R56.2 | v62.38,61 61.38,62 61.38,62.75 57.88,62.75 56.75,63.88 24,63.88 23.88,64 16,64 v15.75,64.25
  Bottom 0.152: v62.38,61 v62.38,58.62 | v15.75,64.25 11.88,60.38 11.88,57.88 C9.-
N$18  (via drill 0.35)
  Top 0.152: D5.A 40.75,36.25 42,37.5 45.12,37.5 46.25,36.38 D13.A 46.38,36.38 47.62,37.62 51.25,37.62 52.25,36.62 D15.C | R56.1 68.75,55.25 v62.38,55.25 | v65,53.12 64.62,52.75 60.5,52.75 v60.38,52.88 | v61.75,44.75 61.5,44.5 55.62,44.5 55.25,44.12 D16.A | D8.C 43.62,43.88 42.38,45.12 36.62,45.12 36,44.5 LED7.K 35.88,44.38 35.25,43.75 30.75,43.75 D2.A 30.62,43.75 27.62,43.75 D1.C 27.5,43.62 15.5,43.62 14.25,42.38 11.5,42.38 10.75,43.12 9.5,43.12 9.5,48.12 v10.62,49.25 | v17.25,72.88 22,77.62 30.38,77.62 31.38,76.62 C10.-
  Bottom 0.152: v62.38,55.25 62.88,54.75 62.88,54.25 64,53.12 v65,53.12 | v60.38,52.88 61.75,51.5 v61.75,44.75 | D15.C 52.38,36.62 55.12,39.38 55.12,44 D16.A | v17.25,72.88 11.25,66.88 11.25,64.5 10.38,63.62 10.38,53.38 10.62,53.12 v10.62,49.25 | D5.A 40.75,36.25 43.62,39.12 43.62,43.75 D8.C
N$19  (via drill 0.35)
  Top 0.152: v40.12,45.88 31.25,45.88 31.12,46 30.62,46 30.5,45.88 25,45.88 24.88,46 13.88,46 13.75,45.88 12.12,45.88 11,47 TREBLE.2
  Bottom 0.152: v40.12,45.88 41.75,47.5 C14.2
N$20  (via drill 0.35)
  Top 0.152: v67.62,75.75 v69.12,75.75 | v65.25,74.88 65,75.12 55.88,75.12 C13.1 55.75,75.12 55.25,74.62 49.75,74.62 49.5,74.88 30.5,74.88 28.88,76.5 C10.+
  Bottom 0.152: v69.12,75.75 69.12,74.38 70.25,73.25 R14.2 | v67.62,75.75 65.75,75.75 65.75,75.38 v65.25,74.88
N$21  (via drill 0.35)
  Top 0.152: v68.5,70.12 68.38,70.25 v63.25,70.25 | v63.5,79.75 63.25,79.5 v57.88,79.5
  Bottom 0.152: v68.5,70.12 71.12,67.5 71.12,66 71.62,65.5 R15.1 | v63.25,70.25 63.5,70.5 v63.5,79.75 | v57.88,79.5 55,76.62 55,75.88 54.75,75.62 54.75,73.75 55.75,72.75 C13.2
N$22  (via drill 0.35)
  Top 0.152: v66.75,74.75 72.88,74.75 v73.25,75.12 | v73.25,81.25 73,81.5 70.5,81.5 69.5,82.5 C11.2
  Bottom 0.152: v66.75,74.75 66.75,73.25 R17.1 | v73.25,81.25 v73.25,75.12
N$23  (via drill 0.35)
  Top 0.152: v58.62,57.38 58,58 57.25,58 56.5,57.25 56.5,56.62 IC9.2 | v16.38,59.88 17.62,61.12 30.38,61.12 31.12,60.38 37.62,60.38 37.75,60.5 R19.2 | v57.38,61.25 55.12,63.5 41.25,63.5 | 41.25,63.5 38.75,63.5 v38.5,63.25 | v70.38,75.38 70.12,75.12 67.25,75.12 66.88,75.5 57,75.5 56.25,76.25 v54.38,76.25 | v54,73.12 53,72.12 v43.88,72.12 | 41.25,63.5 v41.25,63.25
  Bottom 0.152: R16.1 66.38,65.25 66.88,65.75 66.88,70.88 68.12,72.12 72.12,72.12 72.12,73.12 R14.1 72.12,73.25 72.12,75.38 | 72.12,75.38 72.12,82.38 72,82.5 C11.1 | R12.1 56.12,47.5 56.62,48 56.62,52 58.12,53.5 58.12,56.88 v58.62,57.38 57.38,58.62 v57.38,61.25 | v16.38,59.88 16.38,60.75 15.88,61.25 C12.2 | v38.5,63.25 37.88,62.62 37.88,60.62 R19.2 | v70.38,75.38 72.12,75.38 | v54.38,76.25 54,75.88 v54,73.12 | v43.88,72.12 41.5,69.75 41.5,63.5 v41.25,63.25
N$24  (via drill 0.35)
  Top 0.152: v40.88,69 43.12,66.75 55.75,66.75 56.25,66.25 v67.62,66.25
  Bottom 0.152: R17.2 64.88,73.12 64.88,65.62 64.5,65.25 R16.2 64.5,65.12 64.5,63.12 66.25,63.12 67.25,64.12 67.25,66.12 67.62,66.12 | 67.62,66.12 69.12,66.12 69.75,65.5 R15.2 | v40.88,69 39.38,70.5 39.38,76.62 40.5,77.75 BLEND.2 | 67.62,66.12 v67.62,66.25
N$25  (via drill 0.35)
  Top 0.152: v52.5,53.75 43.12,53.75 v43.12,49.62 42.5,49 40.38,49 39.75,49.62 v36.5,49.62 | v52.62,52.25 52.62,50 54.25,50 55.12,50.88 IC9.6 | 55.88,80.12 55.88,81.62 56.25,82 63.38,82 63.75,81.62 65.25,81.62 66.38,82.75 R23.2 | 55.88,80.12 63,80.12 63.38,80.5 73.38,80.5 74.75,81.88 74.75,82.25 R21.1 | v42.38,82.25 50.88,82.25 51.88,81.25 51.88,80.12 55.88,80.12
  Bottom 0.152: v43.12,49.62 43.12,48.12 43.62,47.62 C14.1 | v52.5,53.75 52.62,53.62 v52.62,52.25 | v36.5,49.62 35,51.12 35,58 35.75,58.75 35.75,75.62 v42.38,82.25
N$26  (via drill 0.35)
  Top 0.152: v46,75.88 46.12,76 50.25,76 C16.+ | v51.88,82.12 52.12,82.38 64,82.38 64.38,82.75 R23.1 | v44.12,49.12 45.25,48 54.25,48 54.5,47.75 56.38,47.75 56.38,51.25 IC9.7 | v35.12,62.88 35.38,62.62 42,62.62 42.25,62.88 v43.5,62.88
  Bottom 0.152: 43.75,62.88 43.75,66.12 41.88,68 41.88,69.25 44.62,72 44.62,74.5 v46,75.88 | 43.75,62.88 43.75,59.38 44.12,59 44.12,56.62 44.62,56.12 R24.1 | v51.88,82.12 51.62,81.88 51.62,80.62 50.38,79.38 50.38,76.12 C16.+ | v44.12,49.12 44.62,48.62 44.62,46.75 44.38,46.5 41.25,46.5 41.25,46.12 40.25,45.12 38.38,45.12 38.38,39.38 36.38,37.38 35.75,37.38 33.75,39.38 33.75,49.38 32.88,50.25 32.88,55.5 32.75,55.62 32.75,58.88 33.88,60 33.88,61.62 v35.12,62.88 | 43.75,62.88 v43.5,62.88
N$27  (via drill 0.35)
  Top 0.152: v9.38,79.38 20.75,79.38 22.12,78 33.12,78 35.88,75.25 49.62,75.25 49.88,75 51.88,75 52.88,76 C16.-
  Bottom 0.152: v9.38,79.38 7.38,81.38 R25.2
N$28
  Bottom 0.152: R25.1 5.5,81.38 5.75,81.12 5.75,77.88 VOLUM.3
N$29
  Top 0.152: K1.3 5.25,26 10.25,26 K1.10
N$30
  Top 0.152: R10.1 63.62,53.75 67.5,53.75 R8.2
N$31
  Bottom 0.152: K1.8 10.25,21 7.38,23.88 7.38,46.5 7.25,46.62 7.25,51.75 8.25,52.75 8.25,63.75 10.88,66.38 10.88,77.75 VOLUM.2
N$32  (via drill 0.35)
  Top 0.152: v40.25,52 39.88,52.38 35.12,52.38 34.62,52.88 30.25,52.88 27,49.62 24.38,49.62 23.75,49 v20.62,49 | v20.5,47.75 20.38,47.62 14,47.62 13.5,47.12 TREBLE.1
  Bottom 0.152: v40.25,52 41.25,53 41.25,54.5 42.75,56 R24.2 | v20.62,49 20.5,48.88 v20.5,47.75
N$33  (via drill 0.35)
  Top 0.152: v78.25,43.62 75.62,41 66.75,41 65.25,39.5 DUAL.3
  Bottom 0.152: v78.25,43.62 78.25,56.12 77.12,57.25 77.12,63.5 75.38,65.25 R38.2
N$34  (via drill 0.35)
  Top 0.152: v66.5,49.25 68,49.25 69.38,50.62 R44.1
  Bottom 0.152: v66.5,49.25 66.12,48.88 66.12,46.75 65.25,45.88 65.25,44.62 DUAL.6
N$35
  Top 0.152: R33.1 70.25,47.62 72.38,49.75 72.38,50.62 C15.2
N$36  (via drill 0.35)
  Top 0.152: v23.62,52.62 23.62,54.25 25.5,56.12 31.25,56.12 C20.+ | D17.A 19.38,50.62 23.12,50.62 D18.C
  Bottom 0.152: v23.62,52.62 23.25,52.25 23.25,50.75 D18.C
N$37
  Bottom 0.152: C29.2 69.88,42 70.25,42.38 70.25,44.5 DUAL.5
N$38  (via drill 0.35)
  Top 0.152: v34.38,39.75 24.12,39.75 24,39.88 IC3.2
  Bottom 0.152: v34.38,39.75 35,40.38 35,45.38 36.25,46.62 36.25,48.38 34,50.62 C19.+ 33.88,50.75 33.88,56 C20.-
N$39  (via drill 0.35)
  Top 0.152: 70,70.12 71.5,71.62 R22.2 | 70,70.12 69.38,69.5 67.25,69.5 66.38,68.62 R26.1 | v18.38,22.5 23.5,22.5 24.75,21.25 SW1KL.1 | 70,70.12 69.12,71 68.5,71 68,71.5 67.5,71.5 67,71 65.5,71 65.25,71.25 65.25,73.12 60,73.12 59.88,73 57,73 56.25,73.75 53.62,73.75 52.62,72.75 30.25,72.75 28.12,70.62 v17.25,70.62 | v11,61.88 3.75,54.62 3.75,39 6,39 12.62,32.38 19,32.38 19.88,33.25 IC5.6
  Bottom 0.152: IC5.6 19.88,33.25 18.62,32 18.62,26.88 17.5,25.75 IC5.2 17.5,25.62 17.5,23.38 v18.38,22.5 | v17.25,70.62 11.62,65 11.62,64.38 11,63.75 v11,61.88
N$40
  Bottom 0.152: R7.1 15.25,21.25 18.25,21.25 LED2.K
N$41  (via drill 0.35)
  Top 0.152: v33.12,82.25 35.38,82.25 36,82.88 62.62,82.88 64.62,84.88 74,84.88 74.38,85.25 80.38,85.25 80.38,83.5 79.38,82.5 R41.2 | v28.75,72.12 27.88,71.25 9.5,71.25 v2.12,63.88
  Bottom 0.152: v33.12,82.25 33.12,76.5 v28.75,72.12 | v2.12,63.88 2.38,63.62 2.38,20.88 6,17.25 33.88,17.25 33.88,3.88 35.88,1.88 40.62,1.88 40.62,5 S1.2 40.75,5.12 40.75,17.88 59.25,17.88 60.62,19.25 60.62,22.5 63.5,25.38 63.5,30.88 65.5,32.88 IC6.4
N$42  (via drill 0.35)
  Top 0.152: C35.+ 13.25,49 v18.38,49
  Bottom 0.152: SW2KL.1 27.25,21.12 27.25,19.75 20.88,19.75 19.88,20.75 19.88,20.88 19,21.75 19,29.38 20.25,30.62 R39.1 20.38,30.75 20.88,31.25 20.88,33.75 20.62,34 20.62,46.75 v18.38,49
N$43  (via drill 0.35)
  Top 0.152: v21.25,34.25 12.62,34.25 12.38,34.5 D10.A
  Bottom 0.152: 21.5,30 20,28.5 20,25.75 IC5.3 20,25.62 20,22 20.75,21.25 LED2.A | 21.5,30 22.12,30.62 R39.2 | v21.25,34.25 21.5,34 21.5,30
N$44
  Bottom 0.152: K1.1 5.12,31.12 4.75,31.5 4.75,34.5 D10.C 4.62,34.62 4.62,37.62 D9.C
N$45  (via drill 0.35)
  Top 0.152: v16.88,66.38 v18.75,68.25 | v12,54.25 14.25,52 26.5,52 v27.5,51 | v34.25,26.88 62.5,26.88 63.38,27.75 65.5,27.75 IC6.2
  Bottom 0.152: v18.75,68.25 18.75,66.75 R53.1 | v16.88,66.38 10.75,60.25 10.75,55.5 v12,54.25 | v27.5,51 29,49.5 29,45.12 29.38,44.75 29.38,43.25 32,40.62 32,34.88 29.75,32.62 29.75,31.38 v34.25,26.88
N$46  (via drill 0.35)
  Top 0.152: v28.5,31.62 31.5,31.62 31.62,31.5 SW2.8
  Bottom 0.152: v28.5,31.62 27.62,32.5 27.62,36 D1.A
N$47  (via drill 0.35)
  Top 0.152: v59.88,49.75 63.25,49.75 64.38,48.62 67.25,48.62 68.25,47.62 R33.2 | v59.62,48.25 58,46.62 50.62,46.62 50.38,46.88 49.62,46.88 48.75,46 v48.75,45.62 | v17,64.62 18,65.62 31.62,65.62 T1.B | v18.75,41.88 22.25,38.38 33,38.38 34.88,36.5 35.38,36.5 35.62,36.75 38.38,36.75 40.25,34.88 v50.12,34.88
  Bottom 0.152: v59.88,49.75 59.62,49.5 v59.62,48.25 | v48.75,45.62 49.38,45.62 49.75,45.25 50.5,45.25 | 50.5,45.25 50.5,45.5 51.38,46.38 51.38,50.5 51.62,50.75 R34.2 | v17,64.62 14,61.62 14,55.88 13.75,55.62 13.75,48.25 14.62,47.38 14.62,44.62 15.88,43.38 18.75,43.38 v18.75,41.88 | v50.12,34.88 50.5,35.25 50.5,45.25
N$48
  Bottom 0.152: R53.2 20.12,67.38 20.12,69.12 19.88,69.38 19.88,70 20.5,70.62 23.38,70.62 23.38,69.75 T3.2
N$49  (via drill 0.35)
  Top 0.152: v28.5,37.75 28.88,37.38 33.12,37.38 36.88,33.62 55.25,33.62 56.88,32 70.75,32 71.38,32.62 75.62,32.62 77,31.25 K3.12
  Bottom 0.152: K3.12 77.12,31.25 77.62,31.75 77.62,34.5 D4.A | v28.5,37.75 25.88,40.38 25.88,45 25.25,45.62 25.25,51 24.25,52 24.25,54.12 21.88,56.5 21.88,58.88 22.12,59.12 22.12,68.38 20.88,69.62 T3.3
N$50  (via drill 0.35)
  Top 0.152: v79.12,73 77.62,73 77,72.38 R35.2 | v65.25,86.12 v74.88,86.12 | v36.38,72.12 33.25,72.12 31.75,70.62 T1.E
  Bottom 0.152: v79.12,73 78.75,73.38 78.75,82.25 v74.88,86.12 | v65.25,86.12 64.12,85 64.12,84.38 62.88,83.12 47.25,83.12 47.25,79.38 | 47.25,79.38 47.25,71.12 48.62,69.75 48.62,63.38 48.38,63.12 48.38,62.62 48.75,62.25 50.5,62.25 50.5,63.62 C23.1 | v36.38,72.12 39,74.75 39,78.38 40,79.38 47.25,79.38
N$51  (via drill 0.35)
  Top 0.152: v32.88,33.88 30.75,36 D2.C
  Bottom 0.152: v32.88,33.88 32.88,32.75 34.12,31.5 SW2.7
N$52  (via drill 0.35)
  Top 0.152: v80.12,58.88 75.88,58.88 74.62,60.12 R45.2 | v79.12,31.38 75.25,27.5 67.25,27.5 66.5,26.75 v64.12,26.75
  Bottom 0.152: v80.12,58.88 80.5,58.5 80.5,38 79.12,36.62 v79.12,31.38 | v64.12,26.75 64,26.88 64,28.88 65.5,30.38 IC6.3
N$53  (via drill 0.35)
  Top 0.152: v42.5,58.88 43.75,57.62 43.75,56.62 IC10.2 | v42.5,62.25 v33,62.25 v19.12,62.25 | v80.25,60.12 v77.75,62.62 | v80.38,20.5 77.5,17.62 47.62,17.62 43.62,13.62 | 43.62,13.62 42,12 SW1.7 | 43.62,13.62 38.5,13.62 36.88,12 SW1.5 36.75,12 31.5,17.25 5.5,17.25 5.5,18.25 v7.12,19.88
  Bottom 0.152: v42.5,58.88 42.5,60.5 C24.1 42.5,60.62 v42.5,62.25 | v33,62.25 33,60.88 C26.1 | v77.75,62.62 77.75,64.75 77.25,65.25 R38.1 | v80.25,60.12 80.88,59.5 80.88,21 v80.38,20.5 | v19.12,62.25 18.62,61.75 18.62,60.38 17.75,59.5 17.75,48.25 19.38,46.62 19.38,36.62 15.88,33.12 15.88,23.88 14.12,22.12 14.12,20.38 13.62,19.88 v7.12,19.88
N$54  (via drill 0.35)
  Top 0.152: v35.12,59 38.38,55.75 40.25,55.75 40.88,55.12 41.5,55.12 41.88,55.5 41.88,59.5 42.75,59.5 43.5,58.75 | 43.5,58.75 45,57.25 45,56.62 IC10.1 | v63.5,58.38 63.5,57 R40.2 63.62,56.88 63.88,56.62 v66.12,56.62 | v56.5,66.88 56,67.38 v44.38,67.38 | 43.5,58.75 v44.38,59.62 | SW1.6 39.38,11.88 40.88,10.38 42.88,10.38 44.38,11.88 SW1.8 | v79.75,35.75 77.62,37.88 71.88,37.88 70.38,39.38 DUAL.2 70.25,39.38 68.38,37.5 v58.5,37.5 | v66.12,51.75 65.88,52 60.88,52 v60.38,51.5
  Bottom 0.152: v35.12,59 35.12,60.5 34.88,60.75 C26.2 | v63.5,58.38 63,58.38 62.62,58 60.88,58 60.88,60.88 56.5,65.25 v56.5,66.88 | v44.38,67.38 44.12,67.12 44.12,59.88 v44.38,59.62 | v79.75,35.75 79.75,20.12 76.38,20.12 73.75,17.5 50,17.5 44.5,12 SW1.8 | v66.12,56.62 66.75,56 66.75,52.38 v66.12,51.75 | v60.38,51.5 60.5,51.38 60.5,46 58.5,44 v58.5,37.5
N$55  (via drill 0.35)
  Top 0.152: R54.1 60.75,34.12 v60.25,34.12
  Bottom 0.152: v60.25,34.12 59.5,33.38 59.5,32 58,30.5 IC6.6 57.88,30.38 56.38,28.88 56.38,23.88 SW1TS.1
N$56  (via drill 0.35)
  Top 0.152: v40.62,53.62 40.88,53.38 v41.88,53.38
  Bottom 0.152: v40.62,53.62 40.62,60.5 C24.2 | v41.88,53.38 42.75,52.5 42.75,52 R37.2
N$57  (via drill 0.35)
  Top 0.152: v73,45 v74.5,46.5 | v74.12,32 74.12,28.75 61.5,28.75 60.62,27.88 58,27.88 IC6.7
  Bottom 0.152: v74.5,46.5 74.5,48.25 74.75,48.5 R55.2 | v73,45 73,36.5 74,35.5 74,32.12 v74.12,32
N$58  (via drill 0.35)
  Top 0.152: v39.75,53 41.12,53 41.12,51.38 IC10.5 | v73.12,70.75 71.62,69.25 71.62,68.38 R9.2 | 59,52.25 59,54.25 61.62,56.88 R40.1 | 59,52.25 60.62,52.25 60.75,52.38 v67.75,52.38 | v68.62,61 70.12,62.5 v74.38,62.5 | v39.62,47.25 41.38,45.5 47.12,45.5 48,44.62 48,42.62 56.12,42.62 v57.38,43.88 | 59,52.25 v58.62,51.88
  Bottom 0.152: POT1.1 38.12,68.38 39.12,67.38 39.12,60.38 39.75,59.75 v39.75,53 39.62,52.88 v39.62,47.25 | C25.2 71.5,86.12 73,84.62 73,81.88 72.62,81.5 72.62,74.62 73.12,74.12 v73.12,70.75 73.12,70.62 74.12,69.62 74.12,62.75 v74.38,62.5 | v67.75,52.38 68,52.62 68,59.62 68.62,60.25 v68.62,61 | v57.38,43.88 57.25,44 57.25,46.25 57,46.5 57,48.25 57.5,48.75 58.62,48.75 v58.62,51.88
N$59  (via drill 0.35)
  Top 0.152: v77.88,59.75 76.88,59.75 76.5,60.12 R45.1 | v77.38,37.25 76.88,36.75 74,36.75 73.5,36.25 v67.12,36.25
  Bottom 0.152: v77.88,59.75 78.88,58.75 78.88,38.75 v77.38,37.25 | v67.12,36.25 67.12,24.75 64.38,22 64.38,21.75 GB.AX
N$60  (via drill 0.35)
  Top 0.152: v64.88,50.38 64.12,50.38 63.62,50.88 R50.2 | v63.88,46 63.62,46.25 v61.12,46.25 | v58,49.38 58,47.12 56.75,47.12 56.62,47 50.75,47 50.5,47.25 41.12,47.25 v40.38,48 | 41.62,50 42.38,50.75 42.38,51.25 IC10.6 | 41.62,50 v41.25,49.62 | v44.75,66.12 44.12,65.5 v38.5,65.5 | v37.62,50.25 37.88,50 41.62,50
  Bottom 0.152: v64.88,50.38 64.25,49.75 64.25,46.38 v63.88,46 | v61.12,46.25 61,46.38 61,51.75 60.5,52.25 59.12,52.25 58.88,52.5 58,52.5 v58,49.38 | v40.38,48 41.25,48.88 v41.25,49.62 | v44.75,66.12 45,66.38 45,68.38 43.25,68.38 POT1.3 | v38.5,65.5 36.12,63.12 36.12,56.25 35.38,55.5 35.38,52.5 v37.62,50.25
N$61  (via drill 0.35)
  Top 0.152: v75.62,80.5 77,79.12 77,75.62 74.62,75.62 73.12,74.12 60,74.12 59.88,74.25 56.5,74.25 56.38,74.12 53.5,74.12 52.75,73.38 v50.38,73.38 | v49.75,71.5 49.25,71 POT1.2
  Bottom 0.152: v75.62,80.5 75.62,81.62 74.88,82.38 C27.2 | v50.38,73.38 49.75,72.75 v49.75,71.5
N$62  (via drill 0.35)
  Top 0.152: v66.12,85.5 v73.75,85.5
  Bottom 0.152: v73.75,85.5 76.75,82.5 C27.1 | v66.12,85.5 62.88,82.25 62.88,76.62 63.12,76.38 63.12,71 61.12,69 61.12,65.62 R43.1
N$63  (via drill 0.35)
  Top 0.152: v59.5,50.75 61.5,50.75 61.62,50.88 R50.1 | v59,46 58.88,45.88 v50,45.88 | v50,53.12 43.88,53.12 43.88,51.38 IC10.7
  Bottom 0.152: v59.5,50.75 59,50.25 v59,46 | v50,45.88 50,47.5 C28.1 50,47.62 v50,53.12
N$64  (via drill 0.35)
  Top 0.152: v70,52.38 69.12,52.38 67.5,50.75 R44.2 | v68.12,67.5 63.62,67.5 61.75,69.38 61.75,69.75 v52.5,69.75 | v52,49.38 v50.75,49.38
  Bottom 0.152: v70,52.38 72.25,54.62 72.25,63.12 70.75,64.62 70.75,66.38 69.62,67.5 v68.12,67.5 | v52.5,69.75 51.88,69.12 51.88,57.62 52.5,57 52.5,54.62 51.88,54 51.88,52.88 51,52 50.75,52 v50.75,49.38 | v52,49.38 52.88,48.5 52.88,47.62 C28.2
N$65  (via drill 0.35)
  Top 0.152: v77.62,39.62 80.5,36.75 80.5,27.12 70.75,27.12 68,24.38 68,23.38 60.88,23.38 59.25,21.75 GB.AR
  Bottom 0.152: v77.62,39.62 77.62,47.75 76.88,48.5 R55.1
N$66  (via drill 0.35)
  Top 0.152: v32.62,19.62 36.75,19.62 SW1.4 | v23.62,63.38 23.38,63.62 12.5,63.62 D12.C 12.38,63.75 7.88,63.75 7.25,64.38 LED4.A
  Bottom 0.152: v32.62,19.62 29.12,23.12 29.12,39.75 26.25,42.62 26.25,47.25 26.5,47.5 26.5,51.88 24.62,53.75 24.62,62.38 v23.62,63.38
N$67  (via drill 0.35)
  Top 0.152: v67.38,39.38 65.88,37.88 60.75,37.88 60.12,38.5 T2.B 60,38.5 56.75,38.5 v56.38,38.12
  Bottom 0.152: v67.38,39.38 67.38,41.38 67.88,41.88 C29.1 | v56.38,38.12 56.38,44.62 54.12,46.88 54.12,48.62 54.5,49 54.5,51.75 53.88,52.38 53.88,55.62 53.5,56 R46.1
N$68  (via drill 0.35)
  Top 0.152: v74.38,36.12 74.12,35.88 67.62,35.88 67.38,35.62 v65.75,35.62 | v63.38,43.5 60.12,43.5 T2.E | R47.2 59.75,65.25 56.88,65.25 56.12,64.5 v55,64.5 | v53.88,61.5 53.62,61.75 42.88,61.75 42.75,61.62 38.5,61.62 38.25,61.88 33.5,61.88 33.25,61.62 v30.75,61.62 | v29.75,51.5 27.25,49 v24.62,49 | v26.25,31.38 28.25,29.38 v60.88,29.38
  Bottom 0.152: v74.38,36.12 74.38,35.12 74.88,34.62 R48.1 | 64.62,36.75 63.38,38 v63.38,43.5 | 64.62,36.75 v65.75,35.62 | v55,64.5 54.38,63.88 54.38,62 v53.88,61.5 | v30.75,61.62 29.75,60.62 v29.75,51.5 | v24.62,49 22.25,46.62 22.25,39.62 23.5,38.38 26.25,38.38 v26.25,31.38 | v60.88,29.38 62.25,30.75 62.25,34.38 64.62,36.75
N$69
  Bottom 0.152: LED4.K 7.12,67 7,67.12 7,70.62 LED5.A
N$70
  Bottom 0.152: R48.2 73.12,34.5 73.5,34.12 73.5,31.75 73.62,31.62 73.62,29.62 72.75,28.75 C33.+
N$71  (via drill 0.35)
  Top 0.152: v78.38,66.62 70.88,66.62 70.62,66.88 62.62,66.88 60.88,68.62 R49.2 | v78.38,61.12 80,59.5 80.38,59.5 80.88,59 80.88,21.12 77.12,21.12 K3.8
  Bottom 0.152: v78.38,61.12 v78.38,66.62 | C33.- 75.88,28.62 75.5,28.25 75.5,22.62 77,21.12 K3.8
N$72  (via drill 0.35)
  Top 0.152: v29.75,21.62 37.25,21.62 39.25,19.62 SW1.3 | v24.5,33.88 22,36.38 11.75,36.38 6.88,41.25 6.88,42.38 5.38,42.38 v4.38,43.38 | D12.A 12.38,73.75 12,73.38 7,73.38 LED5.K
  Bottom 0.152: v29.75,21.62 24.5,26.88 v24.5,33.88 | v4.38,43.38 4.62,43.62 4.62,71 6.88,73.25 LED5.K
N$73  (via drill 0.35)
  Top 0.152: v34.88,21 34.12,20.25 28.25,20.25 27.75,19.75 8.38,19.75 5.88,22.25 v4,22.25 | D7.A 13.75,91.62 10,87.88 8.75,87.88 LED3.K
  Bottom 0.152: SW1.2 40.25,21.25 34.88,21.25 v34.88,21 | v4,22.25 3.12,23.12 3.12,82.25 8.62,87.75 LED3.K
N$74  (via drill 0.35)
  Top 0.152: v6.12,18 42.88,18 44.38,19.5 SW1.1
  Bottom 0.152: v6.12,18 2.75,21.38 2.75,83.25 8.25,88.75 9.62,88.75 9.62,86.25 9.38,86 | 9.38,86 8.75,85.38 LED3.A | 9.38,86 9.38,85.88 13.75,81.5 D7.C
N$75
  Bottom 0.152: SW2.6 36.75,31.5 36.12,32.12 36.12,35.75 LED6.A
N$76
  Bottom 0.152: LED6.K 36,38.38 36,41.88 LED7.A
N$77  (via drill 0.35)
  Top 0.152: v74.38,70.25 77.25,70.25 77.25,69.25 77.12,69.12 77.12,68.12 R36.2 | v74,75.88 74,76.25 70.38,79.88 v69.12,79.88 | v67.88,81.12 67.62,80.88 60.12,80.88 v60,80.75 | v52.88,61.12 51.38,59.62 46.62,59.62 46.62,56.38 45.38,55.12 42.5,55.12 42.5,56.5 IC10.3
  Bottom 0.152: v74.38,70.25 74,70.62 v74,75.88 | v67.88,81.12 v69.12,79.88 | v60,80.75 57,77.75 57,71.5 54.62,69.12 54.62,65 53.38,63.75 C23.2 53.25,63.62 53.25,61.5 v52.88,61.12
N$78
  Bottom 0.152: SW2.5 39.25,31.5 38.88,31.88 38.88,42 40.62,43.75 D5.C
N$79
  Bottom 0.152: SW2.4 41.88,31.5 43.62,33.25 43.62,36.12 D8.A
N$80  (via drill 0.35)
  Top 0.152: v30.88,45.38 24.38,45.38 24,45 IC3.4
  Bottom 0.152: v30.88,45.38 31.38,45.88 31.38,50.62 C19.-
N$81
  Bottom 0.152: SW2.3 44.5,31.5 45,32 45,42.62 46.25,43.88 D13.C
N$82
  Top 0.152: D14.C 49.25,44 49.38,44.12 52.25,44.12 D15.A
N$83
  Bottom 0.152: SW2.2 47,31.5 49.12,33.62 49.12,36.25 D14.A
N$84
  Bottom 0.152: SW2.1 49.5,31.5 53.25,35.25 55.12,35.25 55.12,36.38 D16.C
N$85  (via drill 0.35)
  Top 0.152: 77.38,51.12 78.5,52.25 R13.2 | 77.38,51.12 74.38,51.12 72.38,53.12 C15.1 | v79.5,45.62 78.5,46.62 78.12,46.62 77.38,47.38 77.38,51.12
  Bottom 0.152: v79.5,45.62 79.25,45.38 79.25,37.88 76.38,35 76.38,33.38 74.5,31.5 74.5,23.62 72,21.12 K3.5
N$86  (via drill 0.35)
  Top 0.152: 75.12,58.5 77.38,58.5 79,56.88 R57.2 | 75.12,58.5 73.62,58.5 73.62,61.12 73.88,61.38 74.38,61.38 77.12,64.12 R42.1 | v62.75,40.25 63.62,41.12 66.38,41.12 67.75,42.5 v76.25,42.5 | 75.12,58.5 v75.12,58.75
  Bottom 0.152: v62.75,40.25 62.75,35.75 60.25,33.25 60.25,19.38 52.75,19.38 50.75,21.38 50.75,25.38 33.88,25.38 33.25,24.75 33.25,19 7.12,19 5.25,20.88 K1.5 | v76.25,42.5 77,43.25 77,46.5 75.75,47.75 75.75,55 75.5,55.25 75.5,58.38 v75.12,58.75
N$87  (via drill 0.35)
  Top 0.152: v3.75,32.88 1.5,35.12 1.5,80 22,80 IN.1
  Bottom 0.152: v3.75,32.88 3.62,32.75 3.62,25 5.12,23.5 K1.4
N$88  (via drill 0.35)
  Top 0.152: v69.75,25.25 75.5,25.25 77,23.75 K3.9 | v67.25,86.75 68.75,88.25 77.38,88.25 79.5,90.38 OUT.1
  Bottom 0.152: v69.75,25.25 67.62,27.38 67.62,35.88 68.75,37 68.75,41.12 68.88,41.25 68.88,43.75 67.12,45.5 67.12,57.25 63.5,60.88 63.5,69.62 64,70.12 64,74.5 65.75,76.25 66.62,76.25 66.62,77 67.25,77.62 v67.25,86.75
PUENTE
  Top 0.152: K1.9 10.38,23.38 10.62,23.12 30.38,23.12 31.5,22 50.12,22 52.75,19.38 67.62,19.38 71.88,23.62 K3.4
V  (via drill 0.35)
  Top 0.152: v39.12,54.25 51.5,54.25 53.75,56.5 IC9.4 | v16.25,48.38 v38.75,48.38 | C18.- 12,43.5 13.38,44.88 16.25,44.88 IC3.5
  Bottom 0.152: v39.12,54.25 38.75,53.88 v38.75,48.38 | v16.25,48.38 16.25,45 IC3.5
V2  (via drill 0.35)
  Top 0.152: v66.38,46.12 65.25,46.12 64.75,46.62 62.5,46.62 62.5,48.62 62.25,48.88 59.25,48.88 59.25,49.75 57.75,51.25 IC9.8 | v64.62,41.75 61.38,41.75 60.88,42.25 v37.75,42.25 | v35.62,51.38 34.75,52.25 v31.75,52.25 | v30.38,54.88 29.5,55.75 26,55.75 v25.75,55.5 | C21.+ 21.12,60 19.38,58.25 D17.C
  Bottom 0.152: v66.38,46.12 66.75,45.75 66.75,43.88 v64.62,41.75 | v37.75,42.25 37.12,42.88 37.12,49.88 v35.62,51.38 | v31.75,52.25 30.38,53.62 v30.38,54.88 | v25.75,55.5 25.88,55.62 25.88,60 C21.+
VB  (via drill 0.35)
  Top 0.152: IC9.5 53.88,51.38 53.88,54.75 54.38,54.75 55.12,55.5 IC9.3 55.12,58.25 57,58.25 57.12,58.38 v59.88,58.38 | R5.1 63.5,47.62 64.12,47 v65.25,47 67.12,47 67.62,46.5 v71.5,46.5 73.62,46.5 74.88,47.75 76.12,47.75 R1.1 | v49.12,77 48.38,77.75 45.75,77.75 BLEND.1 | v49.75,79.12 50,78.88 63.5,78.88 64,79.38 68.75,79.38 70.25,77.88 GAIN.2 | v62.38,45.62 62.12,45.38 56.75,45.38 v56.62,45.25 | v50.38,28.75 50.12,29 v10.38,29 | v8,33.62 5.12,36.5 3.5,36.5 3.38,36.62 3.38,64.62 6,64.62 7.12,65.75 17.62,65.75 20.62,68.75 30.38,68.75 31.25,69.62 37.5,69.62 40.12,72.25 41.62,72.25 v41.75,72.12
  Bottom 0.152: 65.5,52.5 65.5,52.75 65.75,53 65.75,55 R32.1 | 65.5,52.5 65.5,49.25 65.25,49 R31.2 65.25,48.88 v65.25,47 | v71.5,46.5 71.5,47.5 70.25,48.75 R4.1 | v59.88,58.38 60.12,58.12 60.12,54.25 61.88,52.5 62.38,52.5 | 65.5,52.5 62.38,52.5 | C17.+ 50.12,68.25 49.12,69.25 v49.12,77 50,77.88 50,78.88 v49.75,79.12 | v62.38,45.62 62.38,52.5 | v56.62,45.25 56.75,45.12 56.75,38.62 57,38.38 57,35.38 v50.38,28.75 | v10.38,29 8,31.38 v8,33.62 | v41.75,72.12 45.38,75.75 45.38,77.5 45.62,77.75 BLEND.1
VR  (via drill 0.35)
  Top 0.152: v45.25,49.38 45.5,49.62 47.25,49.62 v47.5,49.38 48.12,48.75 52.5,48.75 52.75,49 53.62,49 | v51.25,58.38 52.38,59.5 v54.25,59.5 | v55.75,49.62 55.12,49 53.62,49 | 53.62,49 v53.62,49.12 | 62.12,72 64.25,72 R52.1 64.38,72 64.38,70.62 67.5,70.62 v67.75,70.88 | 62.12,72 60.88,72 R51.2 | v67.88,68.88 68.38,68.38 69.62,68.38 R9.1 69.75,68.25 70.88,67.12 74.25,67.12 75.12,68 R36.1 75.25,68.12 v76.62,69.5 | v79.88,44.62 75.5,44.62 DUAL.4 | v55,62.75 54.88,62.88 v49,62.88 | 62.12,72 v62.12,72.25
  Bottom 0.152: v45.25,49.38 45.25,51.38 44.75,51.88 R37.1 | v47.5,49.38 48,49.88 48,52.62 C22.+ | v51.25,58.38 51.25,56.38 51.5,56.12 R46.2 | 54.75,59.5 55.75,59.5 v55.75,49.62 | 54.75,59.5 v54.25,59.5 | v53.62,49.12 53.62,50.75 R34.1 | v67.75,70.88 67.88,70.75 v67.88,68.88 | v79.88,44.62 80.12,44.88 80.12,58 79,59.12 79,67.12 v76.62,69.5 | 54.75,59.5 54.75,62.5 v55,62.75 | v49,62.88 49.5,63.38 49.5,65.25 51.5,67.25 51.5,73.25 51,73.75 51,75.25 51.75,76 51.75,76.5 56,80.75 59.38,80.75 59.38,81 59.75,81.38 60.62,81.38 60.62,76.62 62.12,75.12 v62.12,72.25